# EAGLE schematic gemini (EAGLE 7.5.0)
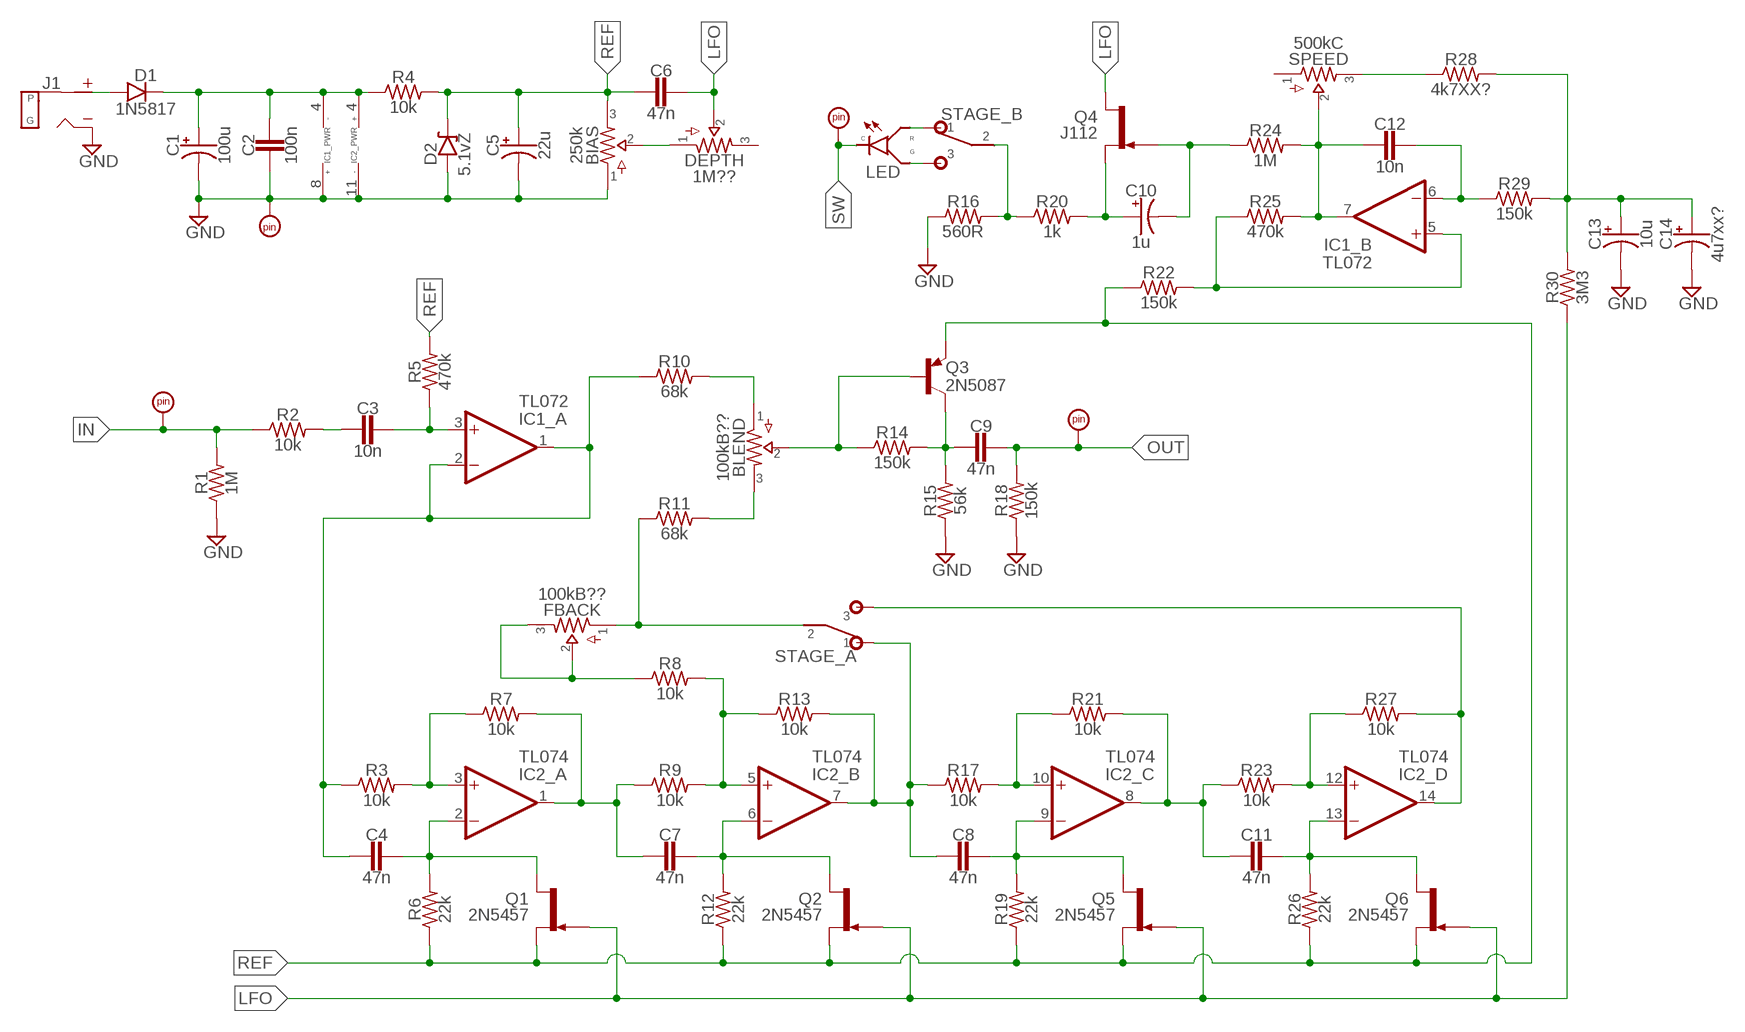
[diagram p0: schematic, sheet 1]

## Parts
BIAS  250k  POTSTRIM  [2262_TRIM]
BLEND  100kB??  POTS16MM  [16MM]
C1  100u  0501  [050_020_1]
C2  100n  CER/FILM2  [050X030_025_2]
C3  10n  CER/FILM2  [050X030_025_2]
C4  47n  CER/FILM2  [050X030_025_2]
C5  22u  0501  [050_020_1]
C6  47n  CER/FILM2  [050X030_025_2]
C7  47n  CER/FILM2  [050X030_025_2]
C8  47n  CER/FILM2  [050X030_025_2]
C9  47n  CER/FILM2  [050X030_025_2]
C10  1u  0501  [050_020_1]
C11  47n  CER/FILM2  [050X030_025_2]
C12  10n  CER/FILM2  [050X030_025_2]
C13  10u  0501  [050_020_1]
C14  4u7xx?  0501  [050_020_1]
D1  1N5817  DO41.2  [DO41-2]
D2  5.1vZ  ZENER.3  [DO41-3]
DEPTH  1M??  POTS16MM  [16MM]
FBACK  100kB??  POTS16MM  [16MM]
IC1  TL072  DUALTH  [DIL08]
IC2  TL074  QUADTH  [DIL14]
J1  DC_MONO  [DC]
LED  LED_DUAL  [LED_DUAL]
PAD1  PADSQR  [SQUARE]
PAD2  PADRND  [ROUND]
PAD3  PADRND  [ROUND]
PAD4  PADSQR  [SQUARE]
Q1  2N5457  [TO92-]
Q2  2N5457  [TO92-]
Q3  2N5087  2N5087.1  [TO92-]
Q4  J112  J201  [TO92-]
Q5  2N5457  [TO92-]
Q6  2N5457  [TO92-]
R1  1M  R_.3B  [R0207/3]
R2  10k  R_.3B  [R0207/3]
R3  10k  R_.3B  [R0207/3]
R4  10k  R_.3B  [R0207/3]
R5  470k  R_.3B  [R0207/3]
R6  22k  R_.3B  [R0207/3]
R7  10k  R_.3B  [R0207/3]
R8  10k  R_.3B  [R0207/3]
R9  10k  R_.3B  [R0207/3]
R10  68k  R_.3B  [R0207/3]
R11  68k  R_.3B  [R0207/3]
R12  22k  R_.3B  [R0207/3]
R13  10k  R_.3B  [R0207/3]
R14  150k  R_.3B  [R0207/3]
R15  56k  R_.3B  [R0207/3]
R16  560R  R_.3B  [R0207/3]
R17  10k  R_.3B  [R0207/3]
R18  150k  R_.3B  [R0207/3]
R19  22k  R_.3B  [R0207/3]
R20  1k  R_.3B  [R0207/3]
R21  10k  R_.3B  [R0207/3]
R22  150k  R_.3B  [R0207/3]
R23  10k  R_.3B  [R0207/3]
R24  1M  R_.3B  [R0207/3]
R25  470k  R_.3B  [R0207/3]
R26  22k  R_.3B  [R0207/3]
R27  10k  R_.3B  [R0207/3]
R28  4k7XX?  R_.3B  [R0207/3]
R29  150k  R_.3B  [R0207/3]
R30  3M3  R_.3B  [R0207/3]
SPEED  500kC  POTS16MM  [16MM]
STAGE  DPDTPCB  [DPDT2_PCB]

## Nets
GND: BIAS.1 C1.- C2.2 C5.- C13.- C14.- D2.A IC1.8(_PWR:V+) IC2.11(_PWR:V-) J1.S(SLEEVE) PAD2.1 R1.1 R15.1 R16.1 R18.1
IN: PAD1.1 R1.2 R2.1
LED: LED.G STAGE.B3
LFO: C6.1 DEPTH.2 Q1.1(G) Q2.1(G) Q4.3(D) Q5.1(G) Q6.1(G) R30.1
N$1: C3.2 R2.2
N$2: C3.1 IC1.3(_A:+IN) R5.1
N$3: C4.2 IC1.1(_A:OUT) IC1.2(_A:-IN) R3.1 R10.1
N$4: BLEND.1 R10.2
N$6: BLEND.2 Q3.2(B) R14.1
N$7: C9.2 Q3.1(C) R14.2 R15.2
N$8: FBACK.2 FBACK.3 R8.1
N$9: C13.+ C14.+ R28.2 R29.2 R30.2
N$10: IC1.5(_B:+IN) R22.2 R25.1
N$11: C12.2 IC1.7(_B:OUT) R24.2 R25.2 SPEED.2
N$12: R28.1 SPEED.3
N$13: C12.1 IC1.6(_B:-IN) R29.1
N$15: C10.- Q4.1(G) R24.1
N$16: C10.+ Q4.2(S) R20.2
N$17: R16.2 R20.1 STAGE.B2
N$18: C1.+ C2.1 D1.C IC1.4(_PWR:V-) IC2.4(_PWR:V+) R4.1
N$19: BLEND.3 R11.2
N$20: IC2.5(_B:+IN) R8.2 R9.2 R13.1
N$21: C4.1 IC2.2(_A:-IN) Q1.3(D) R6.2
N$22: IC2.3(_A:+IN) R3.2 R7.1
N$23: C7.2 IC2.1(_A:OUT) R7.2 R9.1
N$24: C7.1 IC2.6(_B:-IN) Q2.3(D) R12.2
N$25: IC2.14(_D:OUT) R27.2 STAGE.A3
N$26: C8.2 IC2.7(_B:OUT) R13.2 R17.1 STAGE.A1
N$27: C8.1 IC2.9(_C:-IN) Q5.3(D) R19.2
N$28: IC2.10(_C:+IN) R17.2 R21.1
N$29: C11.2 IC2.8(_C:OUT) R21.2 R23.1
N$30: C11.1 IC2.13(_D:-IN) Q6.3(D) R26.2
N$31: IC2.12(_D:+IN) R23.2 R27.1
N$32: FBACK.1 R11.1 STAGE.A2
N$33: BIAS.2 DEPTH.1
N$34: D1.A J1.T(TIP)
N$35: LED.R STAGE.B1
OUT: C9.1 PAD4.1 R18.2
REF: BIAS.3 C5.+ C6.2 D2.C Q1.2(S) Q2.2(S) Q3.3(E) Q5.2(S) Q6.2(S) R4.2 R5.2 R6.1 R12.1 R19.1 R22.1 R26.1
SW: LED.C PAD3.1
Unconnected: DEPTH.3 SPEED.1

## Library data of the parts
BIAS BLEND DEPTH FBACK SPEED = potentiometers:POTS
C1 C5 C10 C13 C14 = capacitors-elec:050: 0.22 - 100uF Xicon values at Mouser.com: 10V: 10 - 100uF; 16V: 2.2 - 47uF; 25V: 0.47 - 47uF; 50V: 0.22 - 22uF
C2-C4 C6-C9 C11 C12 = capacitors-film:CER/FILM: 47 - 120pF Xicon Ceramic Disc 2.5mm lead spacing
D1 = diodes:DO41: DO-41 Package Diodes: 1N4001 - 1N40019 Zener Diodes: 1N4728 - 1N4764
D2 = diodes:ZENER
IC1 = integrated circuits:DUAL: OP AMP
IC2 = integrated circuits:QUAD: OP AMP
J1 = jacks:DC_MONO
LED = diodes:LED_DUAL
PAD1-PAD4 = supply pins:PAD
Q1 Q2 Q5 Q6 = transistors:2N5457: N-CHANNEL JFET
Q3 = transistors:2N5087: PNP Transistor
Q4 = transistors:J201: N-channel JFET
R1-R30 = resistors:R_
STAGE = switches:DPDT